# Altium schematic sheet VL53L3CX.SchDoc
size A4; SheetNumber: 2; SheetTotal: 6
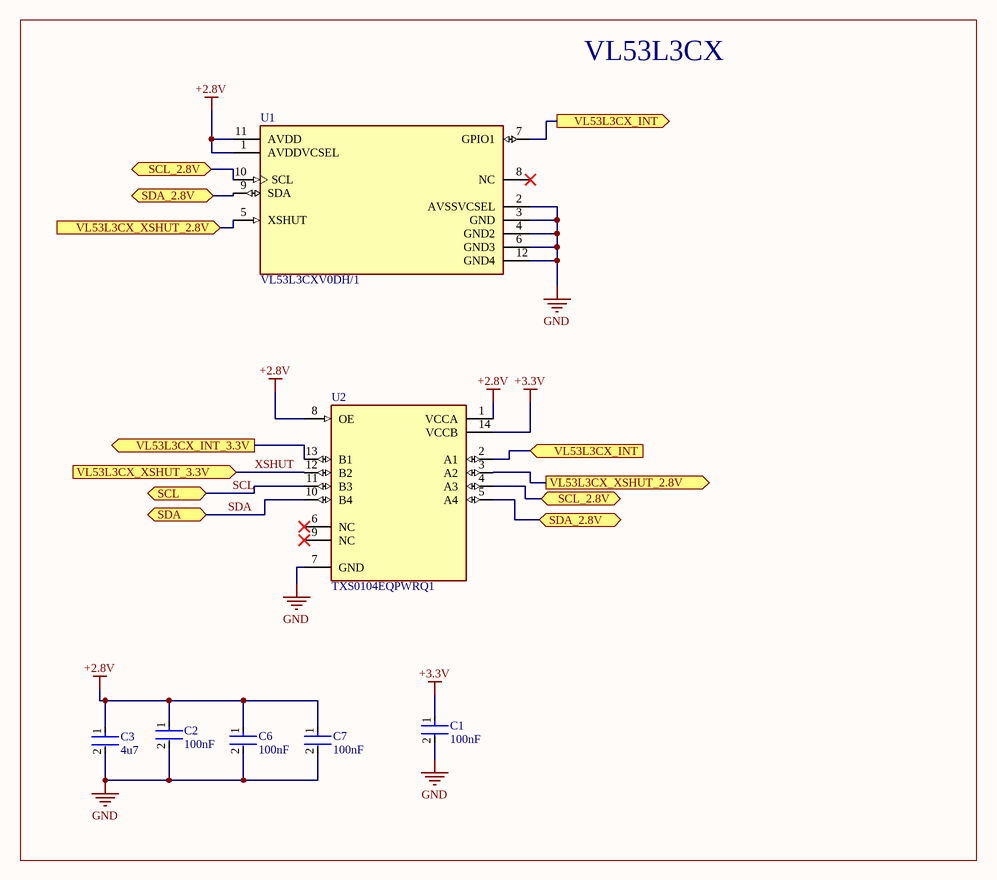
[diagram p0: VL53L3CX.SchDoc]

## Parts
C1  100nF  [FP-C1206C-EB-MFG]
C2  100nF  [FP-C1206C-EB-MFG]
C3  4u7  [FP-GRM21B-0_15-MFG]
C6  100nF  [FP-C1206C-EB-MFG]
C7  100nF  [FP-C1206C-EB-MFG]
U1  VL53L3CXV0DH/1  [FP-LGA-12-DM00392521-MFG]
U2  TXS0104EQPWRQ1  [FP-PW0014A-IPC_C]

## Blocks framed on the sheet
VL53L3CX: C1-C3 C6 C7 U1 U2

## Ports
SCL (bidir, see MCU[2C], Sheet3[5A], Sheet3[6C]), SCL_2.8V (bidir, see Sheet3[6A], Sheet3[7A], VL53L3CX[1A]), SCL_2.8V (bidir, see Sheet3[6A], Sheet3[7A], VL53L3CX[2C]), SDA (bidir, see MCU[2C], Sheet3[5A], Sheet3[6C]), SDA_2.8V (bidir, see Sheet3[6A], Sheet3[7A], VL53L3CX[1A]), SDA_2.8V (bidir, see Sheet3[6A], Sheet3[7A], VL53L3CX[2C]), VL53L3CX_INT (in, see Sheet3[6A], Sheet3[8A], VL53L3CX[2A]), VL53L3CX_INT (out, see Sheet3[6A], Sheet3[8A], VL53L3CX[2B]), VL53L3CX_INT_3.3V (out, see MCU[3C], Sheet3[5A], Sheet3[7B]), VL53L3CX_XSHUT_2.8V (in, see Sheet3[6A], Sheet3[7A], VL53L3CX[2B]), VL53L3CX_XSHUT_2.8V (out, see Sheet3[6A], Sheet3[7A], VL53L3CX[1A]), VL53L3CX_XSHUT_3.3V (in, see MCU[2C], Sheet3[5A], Sheet3[6B])

## Nets
+2.8V: C2.1 C3.1 C6.1 C7.1 U1.1(AVDDVCSEL) U1.11(AVDD) U2.1(VCCA) U2.8(OE)
+3.3V: C1.1 U2.14(VCCB)
GND: C1.2 C2.2 C3.2 C6.2 C7.2 U1.2(AVSSVCSEL) U1.3(GND) U1.4(GND2) U1.6(GND3) U1.12(GND4) U2.7(GND)
SCL: U2.11(B3) ; port SCL
SCL_2.8V: U1.10(SCL) U2.4(A3) ; port SCL_2.8V
SDA: U2.10(B4) ; port SDA
SDA_2.8V: U1.9(SDA) U2.5(A4) ; port SDA_2.8V
VL53L3CX_INT: U1.7(GPIO1) U2.2(A1) ; port VL53L3CX_INT
VL53L3CX_INT_3.3V: U2.13(B1) ; port VL53L3CX_INT_3.3V
VL53L3CX_XSHUT_2.8V: U1.5(XSHUT) U2.3(A2) ; port VL53L3CX_XSHUT_2.8V
XSHUT: U2.12(B2) ; port VL53L3CX_XSHUT_3.3V

Not connected (* = marked no-connect by the designer): U1 8(NC)*; U2 6(NC)* 9(NC)*

## Library data of the parts
C1 C2 C6 C7 = CMP-03020-021070-1: CAP CER 0.1UF 16V 10% X7R 1206; Manufacturer Part Number: C1206C104K4RACTU; Manufacturer: KEMET; Automotive Grade: Grade 0; Tolerance: 0.1; Temperature Coefficient: 15%; Capacitance: 0.10 μF; Material: Ceramic; Value: 0.10 μF; ComponentLink2URL: https://content.kemet.com/datasheets/KEM_C1007_X8R_ULTRA_150C_SMD.pdf; Voltage Rating: 16 V; Temperature Range Low: -55°C; Device Class L3: Ceramic Capacitors; Device Class L1: Passive Components; Lead Free: Yes; Temperature Characteristic: X7R; Package: C1206C-EB; RoHS: TRUE; Ipc Land Pattern Name: CAPC320160X78; Automotive: Yes; Temperature: -55°C to +150°C; Category: Cap; Digikey Description: CAP CER 0.1UF 16V 10% X7R 1206; Mouser Description: Multilayer Ceramic Capacitors MLCC - SMD/SMT 16volts 0.1uF X7R 10%; ComponentLink2Description: Datasheet; Temperature Range High: +150°C; Device Class L2: Capacitors; Height: 0.88mm; Octopart: https://octopart.com/c1206c104k4ractu-kemet-12577600
C3 = CMP-06035-005997-1: Chip Multilayer Ceramic Capacitors for General Purpose, 0805, 4.7uF, X7R, 15%, 10%, 10V; Tolerance: 10%; Capacitance: 4.7uF; Width: 1.25mm; Case/Package: 0805; Voltage Rating (DC): 10V; Thickness: 1.25mm; Dielectric: X7R; Length: 2mm
U1 = CMP-12178-000002-1: TIME-OF-FLIGHT PROXIMITY SENSOR
U2 = CMP-04899-000064-1: IC TRNSLTR BIDIRECTIONAL 14TSSOP; Min Supply Voltage: 1.65V; Quiescent Current: 14.4uA; Data Rate: 24Mbps; Logic Function: Translator; Number of Circuits: 1; Number of Bits: 4; Low Level Output Current: 1mA; Max Supply Voltage: 5.5V; High Level Output Current: -20uA; Operating Supply Current: 25uA; Propagation Delay: 4.6ns; Contact Plating: Gold; Package Quantity: 2000; Number of Pins: 14; Lead Free: Lead Free; Weight: 0.004949oz; Min Operating Temperature: -40°C; Number of Channels: 4; Packaging: Tape and Reel; Mount: Surface Mount; Max Operating Temperature: 125°C; Case/Package: TSSOP; Channel Type: Bidirectional; RoHS Compliant: Yes; Radiation Hardening: No